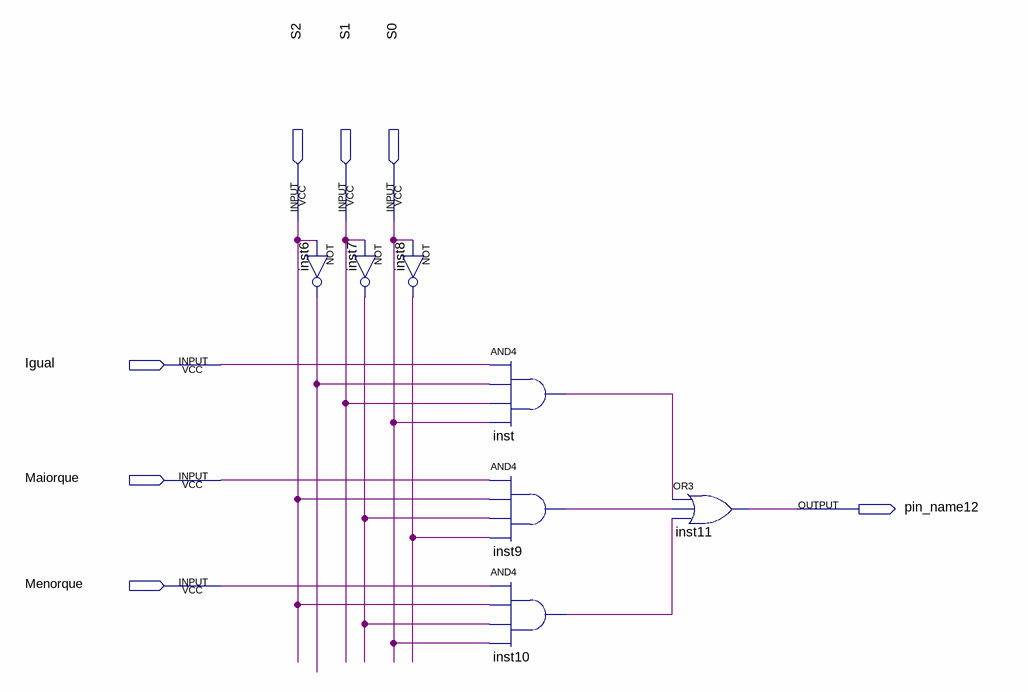
[diagram p0: schematic sheet]
// Quartus schematic Multiplexador_1bit.bdf as structural Verilog: 7 symbols, 7 pins
module Multiplexador_1bit (
  input  S2,
  input  S1,
  input  S0,
  input  Igual,
  input  Maiorque,
  input  Menorque,
  output pin_name12
);

  wire inst6_out, inst7_out, inst8_out, inst9_out, inst10_out, inst_out;

  not inst6 (inst6_out, S2);
  not inst7 (inst7_out, S1);
  not inst8 (inst8_out, S0);
  and inst (inst_out, Igual, inst6_out, S1, S0);
  and inst9 (inst9_out, Maiorque, S2, inst7_out, inst8_out);
  and inst10 (inst10_out, Menorque, S2, inst7_out, S0);
  or inst11 (pin_name12, inst_out, inst9_out, inst10_out);
endmodule
